# Altium project Front.PrjPcb
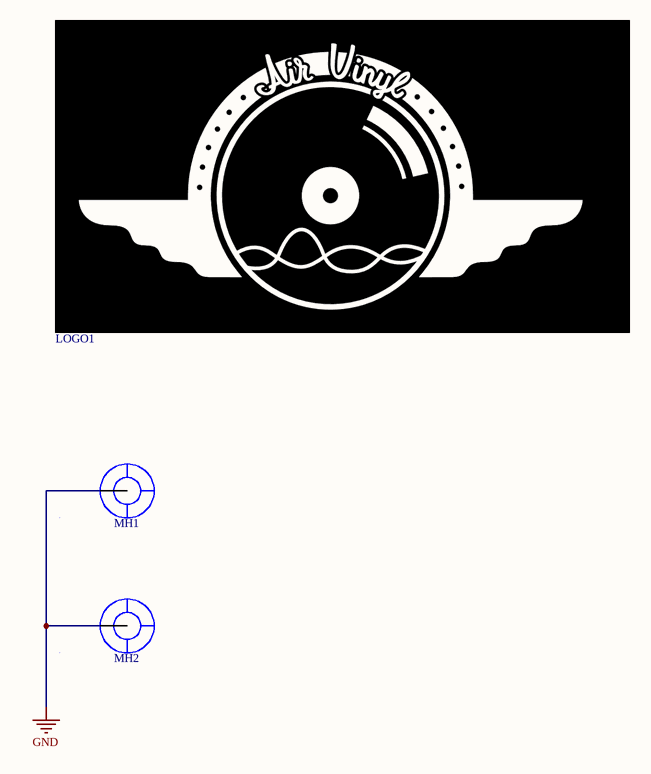
[diagram p0: Front.SchDoc]
1 sheet, 3 parts. Net scope: global (net labels, ports and power ports of the same name join across sheets).
Board file: Front.PcbDoc

## Sheet Front.SchDoc
size A3

### Parts
LOGO1  Air Vinyl  [LOGO-AIR-Vinyl]  (value not drawn)  (no BOM)
MH1  Mounting hole  [MECH_MHOLE_3.5-GND-2]  (value not drawn)  (no BOM)
MH2  Mounting hole  [MECH_MHOLE_3.5-GND-2]  (value not drawn)  (no BOM)

### Nets
GND: MH1.1(NET) MH2.1(NET)

### Library data of the parts
LOGO1 = LOGO-AirVinyl: LOGO AIR Vinyl
MH1 MH2 = MECH_MHOLE_NET